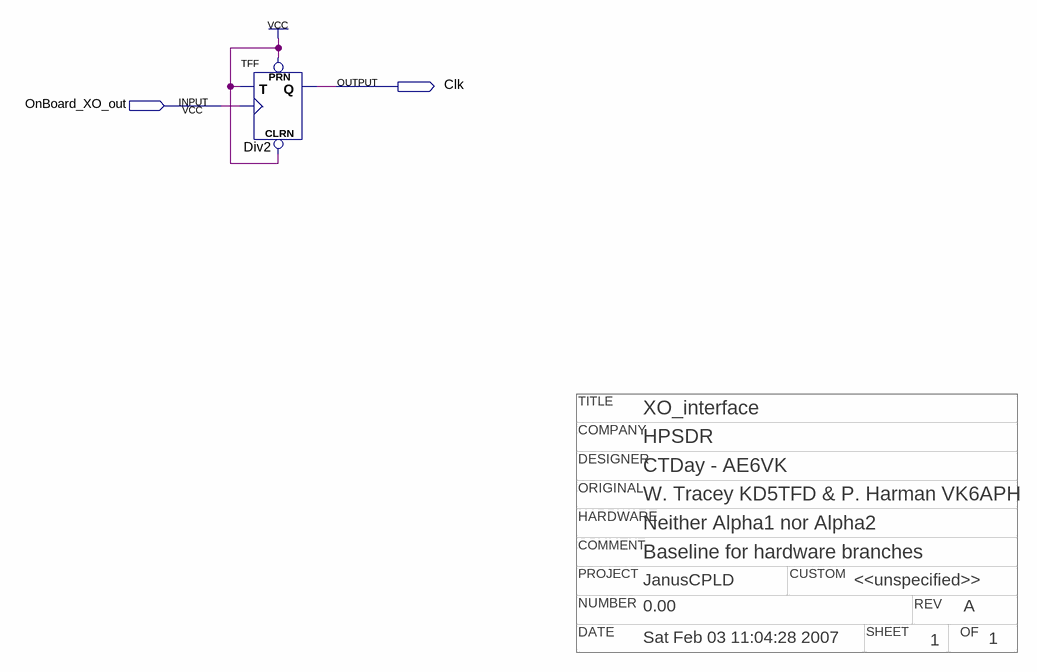
[diagram p0: schematic sheet]
// Quartus schematic XO_interface.bdf as structural Verilog: 1 symbols, 2 pins
// Title block: TITLE: XO_interface; COMPANY: HPSDR; DESIGNER: CTDay - AE6VK; NUMBER: 0.00; REV: A; DATE: Sat Feb 03 11:04:28 2007; SHEET: 1; OF: 1; ORIGINAL: W. Tracey KD5TFD & P. Harman VK6APH; HARDWARE: Neither Alpha1 nor Alpha2; COMMENT: Baseline for hardware branches; PROJECT: JanusCPLD; CUSTOM: <<unspecified>>
module XO_interface (
  input  OnBoard_XO_out,
  output Clk
);

  TFF Div2 (.PRN(1'b1), .CLRN(1'b1), .T(1'b1), .CLK(OnBoard_XO_out), .Q(Clk));
endmodule
